# EAGLE design ledBloom (EAGLE 8.7.0)
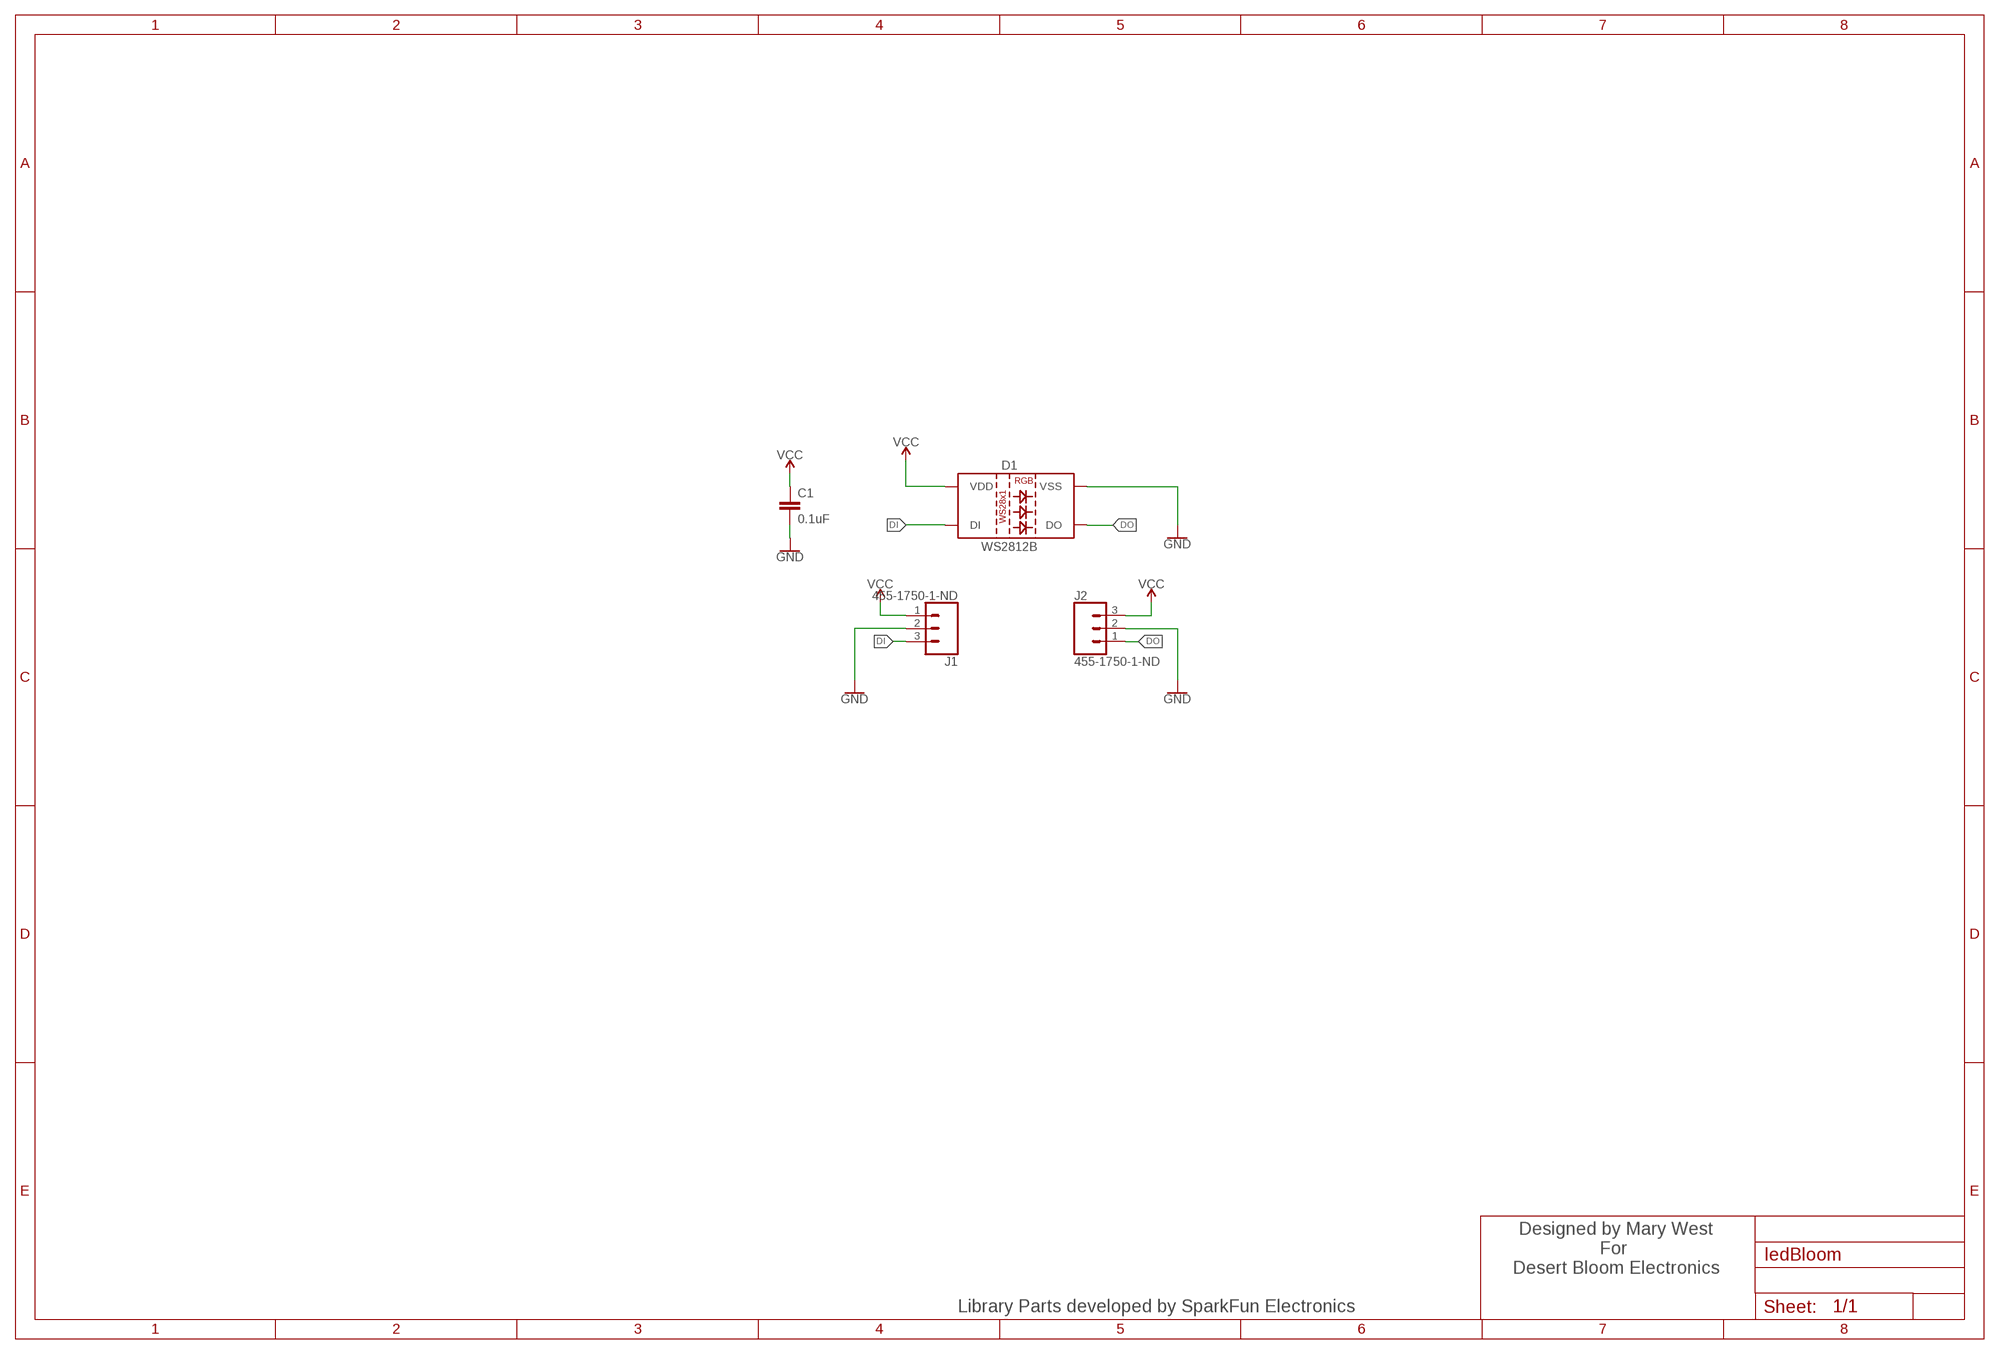
[diagram p0: schematic, sheet 1]

## Parts
C1  0.1uF  0.1UF-0603-25V-(+80/-20%)  [0603]
D1  WS2812B  [WS2812B]
J1  455-1750-1-ND  CONN_03  [1X03]
J2  455-1750-1-ND  CONN_03  [1X03]

## Nets
DI: D1.4(DI) J1.3
DO: D1.2(DO) J2.1
GND: C1.2 D1.3(VSS) J1.2 J2.2
VCC: C1.1 D1.1(VDD) J1.1 J2.3

## Notes on the sheet
- Designed by Mary West
  For 
  Desert Bloom Electronics
- Library Parts developed by SparkFun Electronics

## Library data of the parts
C1 = SparkFun-Capacitors:0.1UF: 0.1µF ceramic capacitors A capacitor is a passive two-terminal electrical component used to store electrical energy temporarily in an electric field.; PROD_ID: CAP-00810
D1 = SparkFun-LED:WS2812B: WS2812B SMD addressable RGB LED 5x5mm SMD LED with built-in controller IC. Color: Red/Green/Blue mC Rating: RGB: 390, 660, 180 mcd Forward Voltage: RGB: 2.0, 3.0, 3.0 V Packages:WS2812B SparkFun Products: Blynk Board - ESP8266 <https://www.sparkfun.com/products/13794>; PROD_ID: DIO-12503
J1 J2 = SparkFun-Connectors:CONN_03: Multi connection point. Often used as Generic Header-pin footprint for 0.1 inch spaced/style header connections On any of the 0.1 inch spaced packages, you can populate with these: Break Away Headers - Straight <https://www.sparkfun.com/products/116> (PRT-00116) Break Away Male Headers - Right Angle <https://www.sparkfun.com/products/553> (PRT-00553) Female Headers <https://www.sparkfun.com/products/115> (PRT-00115) Break Away Headers - Machine Pin <https://www.sparkfun.com/products/117> (PRT-00117) Break Away Female Headers - Swiss Machine Pin <https://www.sparkfun.com/products/743> (PRT-00743) Stackable Header - 3 Pin (Female, 0.1") <https://www.sparkfun.com/products/13875> (PRT-13875) For SCREWTERMINALS and SPRING TERMINALS visit here: Screw Terimnals on SparkFun.com <https://www.sparkfun.com/search/results?term=Screw+Terminals> (5mm/3.5mm/2.54mm spacing) This device is also useful as a general connection point to wire up your design to another part of your project. Our various solder wires solder well into these plated through hole pads. Hook-Up Wire - Assortment (Stranded, 22 AWG) <https://www.sparkfun.com/products/11375> (PRT-11375) Hook-Up Wire - Assortment (Solid Core, 22 AWG) <https://www.sparkfun.com/products/11367> (PRT-11367) View the entire wire category on our website here <https://www.sparkfun.com/categories/141> Special notes: Molex polarized connector foot print use with SKU : PRT-08232 with associated crimp pins and housings.; PROD_ID: XXX-00000

## Board
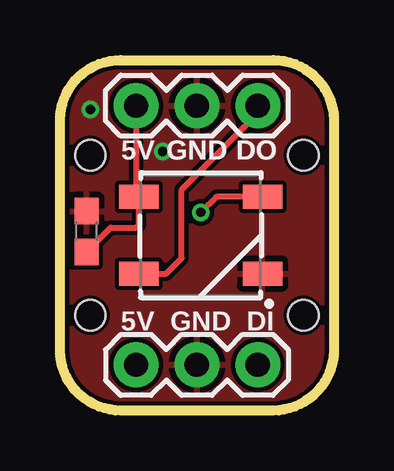
[diagram p1: board, top side]
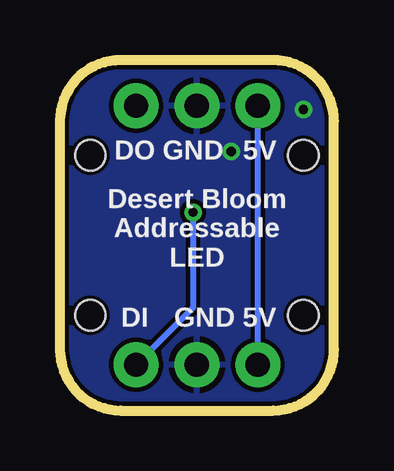
[diagram p2: board, bottom side, seen from below]

Size 11.43 x 14.61 mm. Coordinates in mm from the lower left corner, seen from the top.
Outline: 11.43,12.06 11.43,2.54 arc-90 8.89,0 2.54,0 arc-90 0,2.54 0,12.06 arc-90 2.54,14.61 8.89,14.61 arc-90 11.43,12.06
Copper layers (1*16): Top 0.035mm / dielectric 1.5mm / Bottom 0.035mm
Design rules "SparkFun-2-layer-TIGHT": minimum track width 7mil, minimum drill 15mil, track to track 7mil, track to pad 7mil, pad to pad 7mil, via to via 7mil, smd to smd 7mil, copper to edge 7mil, drill to drill 7mil, minimum pad ring 7mil, minimum via ring 7mil, stop-mask expansion 4mil, vias tented up to drill 25mil, thermal gap 10mil
Holes 1.27 mm at 1.27,10.64 1.27,3.97 10.16,10.64 10.16,3.97

### Footprints (pad centres in the part's own frame; a part is rotated, then mirrored left to right if it is on the bottom)
0603 = smd 1.1 x 1: 1 -0.85,0; 2 0.85,0
WS2812B = smd 1.651 x 1: 1 2.577,-1.6; 2 2.577,1.6; 3 -2.577,1.6; 4 -2.577,-1.6
1X03 = drill 1.016 pad 1.88: 1 0,0; 2 2.54,0; 3 5.08,0

### Placement (x,y rotation side)
C1  1.11,7.46 90 top
D1  5.87,7.3 180 top
J1  3.17,1.91 0 top
J2  8.25,12.7 180 top

### Tracks (layer width: path | path; a pad name or v marks a point on that pad's centre or on a via)
DI  (via drill 0.38)
  Top 0.254: D1.4 6.52,8.9 v5.87,8.26
  Bottom 0.254: v5.87,8.26 5.87,4.29 J1.3
DO
  Top 0.254: D1.2 4.43,5.7 5.08,6.35 5.08,9.21 8.25,12.38 J2.1
GND  (via drill 0.38)
  other vias: 4.29,10.79 1.27,12.54
  pour Bottom: 0,2.38 0,12.06 arc-90 2.54,14.61 8.89,14.61 arc-90 11.43,12.06 11.43,2.54 arc-90 8.89,0 2.38,0 arc-90
  pour Top: 0,2.38 0,12.22 arc-90 2.38,14.61 9.05,14.61 arc-90 11.43,12.22 11.43,2.38 arc-90 9.05,0 2.54,0 arc-86
VCC
  Top 0.254: 1.21,6.51 1.16,6.56 | 1.16,6.56 C1.1 2.12,7.62 3.17,7.62 3.3,7.74 3.3,8.73 | 1.27,6.67 1.16,6.56 | 3.3,8.73 D1.1 | J2.3 3.17,8.85 3.3,8.73
  Bottom 0.254: J1.1 J2.3

### Text on the board
tPlace: 5V | GND | GND | DO | DO | 5V | GND | DI
bPlace: 5V | GND | DO | Desert Bloom / Addressable / LED | 5V | GND | DI